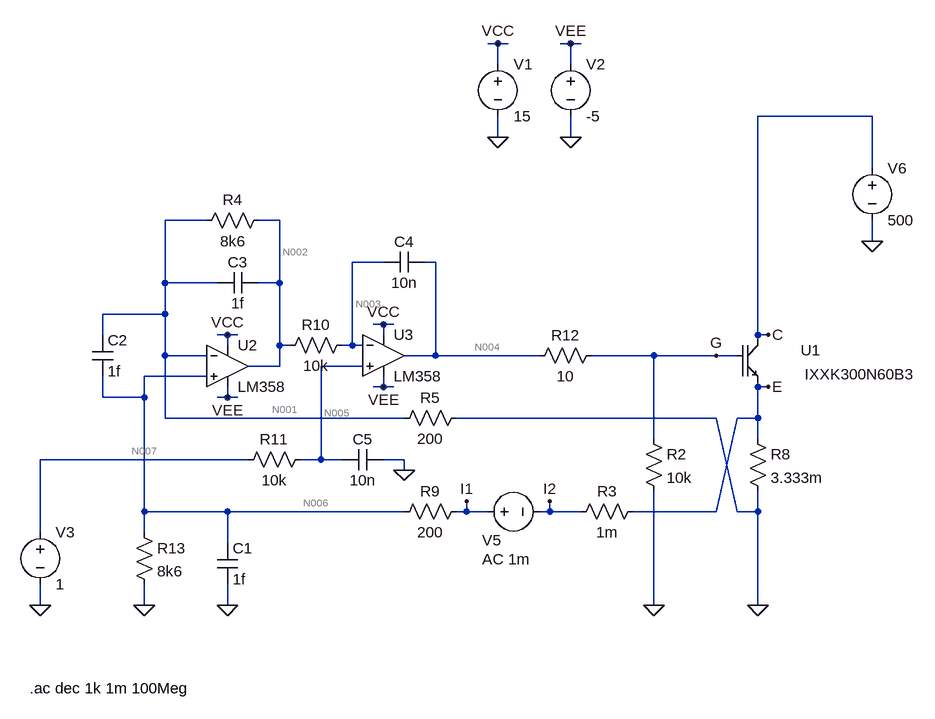
[diagram p0: schematic ConstantCurrentLoopGainPhaseMargin.asc]
ConstantCurrentLoopGainPhaseMargin.asc, the LTspice schematic file:
Version 4
SHEET 1 880 980
WIRE -160 -336 -176 -336
WIRE -144 -336 -160 -336
WIRE -48 -336 -64 -336
WIRE -32 -336 -48 -336
WIRE -160 -304 -160 -336
WIRE -48 -304 -48 -336
WIRE 416 -224 240 -224
WIRE -160 -192 -160 -224
WIRE -48 -192 -48 -224
WIRE 416 -144 416 -224
WIRE -608 -64 -672 -64
WIRE -496 -64 -528 -64
WIRE 416 -32 416 -64
WIRE -336 0 -384 0
WIRE -256 0 -272 0
WIRE -672 32 -672 -64
WIRE -592 32 -672 32
WIRE -496 32 -496 -64
WIRE -496 32 -528 32
WIRE -672 80 -672 32
WIRE -672 80 -768 80
WIRE -336 96 -352 96
WIRE -320 96 -336 96
WIRE -768 112 -768 80
WIRE -576 112 -592 112
WIRE -560 112 -576 112
WIRE -336 112 -336 96
WIRE 240 112 240 -224
WIRE 256 112 240 112
WIRE -576 128 -576 112
WIRE -496 128 -496 32
WIRE -480 128 -496 128
WIRE -384 128 -384 0
WIRE -384 128 -400 128
WIRE -368 128 -384 128
WIRE -672 144 -672 80
WIRE -608 144 -672 144
WIRE -256 144 -256 0
WIRE -256 144 -304 144
WIRE -96 144 -256 144
WIRE 80 144 -16 144
WIRE 176 144 80 144
WIRE 208 144 176 144
WIRE -496 160 -496 128
WIRE -496 160 -544 160
WIRE -368 160 -432 160
WIRE -608 176 -704 176
WIRE -336 192 -336 176
WIRE -336 192 -352 192
WIRE -320 192 -336 192
WIRE 256 192 240 192
WIRE -768 208 -768 176
WIRE -704 208 -704 176
WIRE -704 208 -768 208
WIRE -576 208 -576 192
WIRE -576 208 -592 208
WIRE -560 208 -576 208
WIRE -672 240 -672 144
WIRE -304 240 -672 240
WIRE 176 240 -224 240
WIRE 240 240 240 192
WIRE 240 240 208 240
WIRE 80 272 80 144
WIRE 240 272 240 240
WIRE -544 304 -864 304
WIRE -432 304 -432 160
WIRE -432 304 -464 304
WIRE -400 304 -432 304
WIRE -304 304 -336 304
WIRE -304 320 -304 304
WIRE -704 384 -704 208
WIRE -576 384 -704 384
WIRE -304 384 -576 384
WIRE -208 384 -208 368
WIRE -208 384 -224 384
WIRE -176 384 -208 384
WIRE -80 384 -80 368
WIRE -80 384 -96 384
WIRE -32 384 -80 384
WIRE 176 384 208 240
WIRE 176 384 48 384
WIRE 208 384 176 240
WIRE 240 384 240 352
WIRE 240 384 208 384
WIRE -864 416 -864 304
WIRE -704 416 -704 384
WIRE -576 432 -576 384
WIRE -864 528 -864 496
WIRE -704 528 -704 496
WIRE -576 528 -576 496
WIRE 80 528 80 352
WIRE 240 528 240 384
FLAG 240 528 0
FLAG -48 -192 0
FLAG -160 -192 0
FLAG -576 112 VCC
FLAG -576 208 VEE
FLAG -48 -336 VEE
FLAG -160 -336 VCC
FLAG 256 192 E
FLAG 256 112 C
FLAG 176 144 G
FLAG -336 96 VCC
FLAG -336 192 VEE
FLAG -864 528 0
FLAG 80 528 0
FLAG -704 528 0
FLAG -576 528 0
FLAG -304 320 0
FLAG 416 -32 0
FLAG -80 368 I2
FLAG -208 368 I1
SYMBOL IXXK300N60B3 240 144 R0
WINDOW 3 156 13 Top 2
WINDOW 0 81 7 Bottom 2
SYMATTR InstName U1
SYMBOL res 64 256 R0
SYMATTR InstName R2
SYMATTR Value 10k
SYMBOL LM358 -576 160 R0
SYMATTR InstName U2
SYMBOL voltage -160 -320 R0
WINDOW 123 0 0 Left 0
WINDOW 39 0 0 Left 0
SYMATTR InstName V1
SYMATTR Value 15
SYMBOL voltage -48 -320 R0
WINDOW 123 0 0 Left 0
WINDOW 39 0 0 Left 0
SYMATTR InstName V2
SYMATTR Value -5
SYMBOL voltage -864 400 R0
WINDOW 123 0 0 Left 0
WINDOW 39 0 0 Left 0
SYMATTR InstName V3
SYMATTR Value 1
SYMBOL res -208 224 R90
WINDOW 0 0 56 VBottom 2
WINDOW 3 32 56 VTop 2
SYMATTR InstName R5
SYMATTR Value 200
SYMBOL res 224 256 R0
SYMATTR InstName R8
SYMATTR Value 3.333m
SYMBOL cap -528 16 R90
WINDOW 0 0 32 VBottom 2
WINDOW 3 32 32 VTop 2
SYMATTR InstName C3
SYMATTR Value 1f
SYMBOL res -512 -80 R90
WINDOW 0 0 56 VBottom 2
WINDOW 3 32 56 VTop 2
SYMATTR InstName R4
SYMATTR Value 8k6
SYMBOL LM358 -336 144 R0
SYMATTR InstName U3
SYMBOL voltage -192 384 R270
WINDOW 0 -44 8 VRight 2
WINDOW 123 -73 8 VRight 2
WINDOW 39 0 0 Left 0
SYMATTR InstName V5
SYMATTR Value2 AC 1m
SYMATTR Value ""
SYMBOL res -208 368 R90
WINDOW 0 0 56 VBottom 2
WINDOW 3 32 56 VTop 2
SYMATTR InstName R9
SYMATTR Value 200
SYMBOL res -720 400 R0
SYMATTR InstName R13
SYMATTR Value 8k6
SYMBOL cap -592 432 R0
SYMATTR InstName C1
SYMATTR Value 1f
SYMBOL cap -272 -16 R90
WINDOW 0 0 32 VBottom 2
WINDOW 3 32 32 VTop 2
SYMATTR InstName C4
SYMATTR Value 10n
SYMBOL res -384 112 R90
WINDOW 0 0 56 VBottom 2
WINDOW 3 32 56 VTop 2
SYMATTR InstName R10
SYMATTR Value 10k
SYMBOL res -448 288 R90
WINDOW 0 0 56 VBottom 2
WINDOW 3 32 56 VTop 2
SYMATTR InstName R11
SYMATTR Value 10k
SYMBOL cap -336 288 R90
WINDOW 0 0 32 VBottom 2
WINDOW 3 32 32 VTop 2
SYMATTR InstName C5
SYMATTR Value 10n
SYMBOL voltage 416 -160 R0
WINDOW 123 0 0 Left 0
WINDOW 39 0 0 Left 0
SYMATTR InstName V6
SYMATTR Value 500
SYMBOL res 0 128 R90
WINDOW 0 0 56 VBottom 2
WINDOW 3 32 56 VTop 2
SYMATTR InstName R12
SYMATTR Value 10
SYMBOL res 64 368 R90
WINDOW 0 0 56 VBottom 2
WINDOW 3 32 56 VTop 2
SYMATTR InstName R3
SYMATTR Value 1m
SYMBOL cap -784 112 R0
SYMATTR InstName C2
SYMATTR Value 1f
TEXT -880 656 Left 2 !.ac dec 1k 1m 100Meg

The netlist it stands for:
* ConstantCurrentLoopGainPhaseMargin.asc
XU1 C G E IXXK300N60B3 IXXK300N60B3  ; pins C G E
R2 G 0 10k
* U2: LM358 (symbol LM358 not available, pins judged from their places): In+=N006 In-=N001 V+=VCC V-=VEE OUT=N002
V1 VCC 0 15
V2 VEE 0 -5
V3 N007 0 1
R5 0 N001 200
R8 E 0 3.333m
C3 N002 N001 1f
R4 N002 N001 8k6
* U3: LM358 (symbol LM358 not available, pins judged from their places): In+=N005 In-=N003 V+=VCC V-=VEE OUT=N004
V5 I1 I2 AC 1m
R9 I1 N006 200
R13 N006 0 8k6
C1 N006 0 1f
C4 N004 N003 10n
R10 N003 N002 10k
R11 N005 N007 10k
C5 0 N005 10n
V6 C 0 500
R12 G N004 10
R3 E I2 1m
C2 N001 N006 1f
.ac dec 1k 1m 100Meg
.lib ixxk300n60b3.lib
.backanno
.end

* Results of the author's LTspice run, read from the files saved beside the schematic
* Operating Point, zero values left out:
*   V(c) = 500 V
*   V(e) = 23.21 mV
*   V(g) = 6.777 V
*   V(n006) = 22.69 mV
*   V(vee) = -5 V
*   V(n001) = 22.73 mV
*   V(vcc) = 15 V
*   V(n002) = 1 V
*   V(n007) = 1 V
*   V(n005) = 1 V
*   V(n003) = 1 V
*   V(n004) = 6.784 V
*   V(i1) = 23.21 mV
*   V(i2) = 23.21 mV
*   I(R2) = 677.7 µA
*   I(R5) = -113.6 µA
*   I(R8) = 6.965 A
*   I(R4) = 113.6 µA
*   I(R9) = 2.628 µA
*   I(R13) = 2.638 µA
*   I(R10) = 10 nA
*   I(R11) = 9.997 nA
*   I(R12) = -677.7 µA
*   I(R3) = 2.628 µA
*   I(V1) = -686.1 µA
*   I(V2) = -105.3 µA
*   I(V3) = 9.997 nA
*   I(V5) = -2.628 µA
*   I(V6) = -6.965 A
*   Ix(u1:C) = 6.965 A
*   Ix(u1:E) = -6.965 A
*   Ix(u2:1) = -9.994 nA
*   Ix(u2:2) = -10.01 nA
*   Ix(u2:3) = -113.6 µA
*   Ix(u2:4) = 343.8 µA
*   Ix(u2:5) = -230.2 µA
*   Ix(u3:1) = -10 nA
*   Ix(u3:2) = -9.997 nA
*   Ix(u3:3) = -677.7 µA
*   Ix(u3:4) = 342.2 µA
*   Ix(u3:5) = 335.5 µA